# Altium schematic sheet 5-Connector.SchDoc
size A4
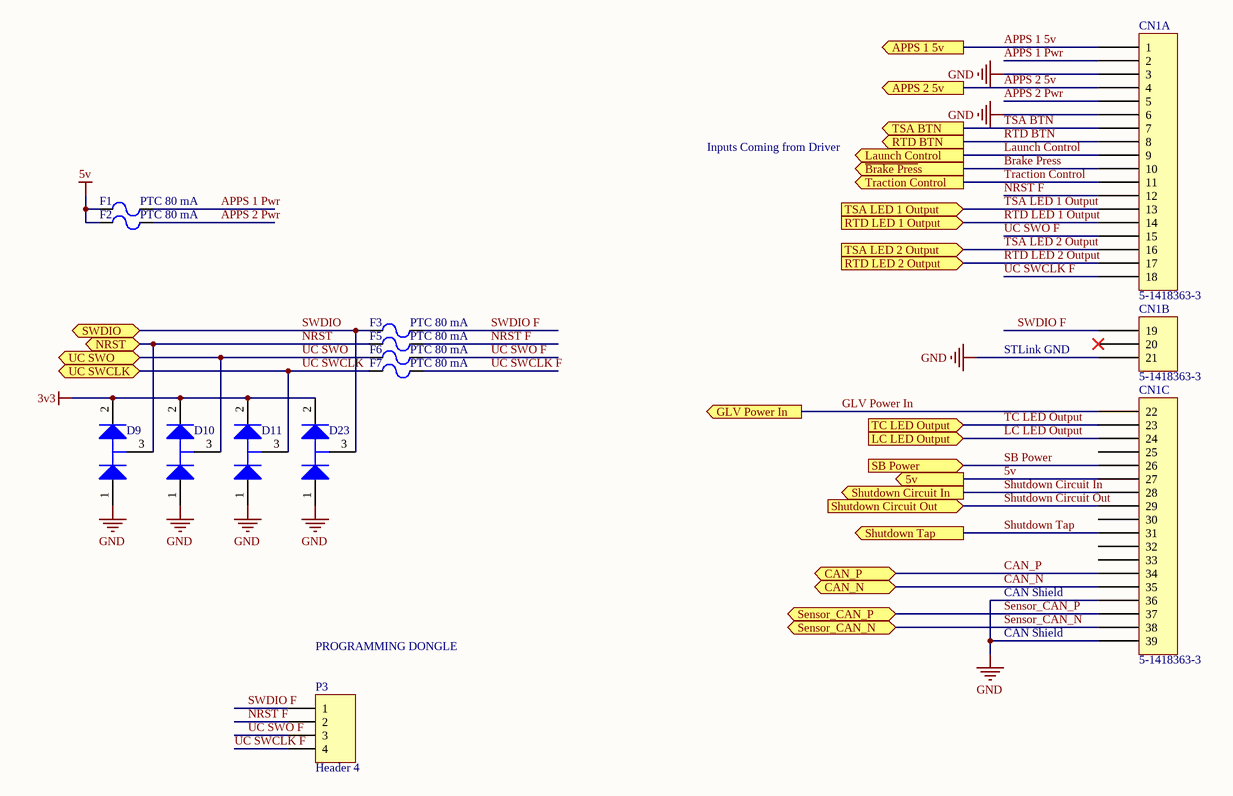
[diagram p0: 5-Connector.SchDoc]

## Parts
CN1  5-1418363-3  [5-1418363-3]  (parts A,B,C of 3)
D9  SZNUP1301ML3T1G  [ONSC-SOT-23-3-318-08_V]  (value not drawn)
D10  SZNUP1301ML3T1G  [ONSC-SOT-23-3-318-08_V]  (value not drawn)
D11  SZNUP1301ML3T1G  [ONSC-SOT-23-3-318-08_V]  (value not drawn)
D23  SZNUP1301ML3T1G  [ONSC-SOT-23-3-318-08_V]  (value not drawn)
F1  PTC 80 mA  [0603 fuse]
F2  PTC 80 mA  [0603 fuse]
F3  PTC 80 mA  [0603 fuse]
F5  PTC 80 mA  [0603 fuse]
F6  PTC 80 mA  [0603 fuse]
F7  PTC 80 mA  [0603 fuse]
P3  Header 4  [HDR1X4]

## Ports
5v (out), APPS 1 5v (out), APPS 2 5v (out), CAN_N (bidir), CAN_P (bidir), GLV Power In (out), Launch Control (out), LC LED Output (in), NRST (bidir), RTD BTN (out), RTD LED 1 Output (in), RTD LED 2 Output (in), SB Power (in), Sensor_CAN_N (bidir), Sensor_CAN_P (bidir), Shutdown Circuit In (out), Shutdown Circuit Out (in), Shutdown Tap (out), SWDIO (bidir), TC LED Output (in), Traction Control (out), TSA BTN (out), TSA LED 1 Output (in), TSA LED 2 Output (in), UC SWCLK (bidir), UC SWO (bidir), ~{Brake Pres}s (out)

## Nets
3v3: D9.2(K) D10.2(K) D11.2(K) D23.2(K)
5v: CN1.27 F1.1 F2.1 ; port 5v
GND: CN1.3 CN1.6 CN1.21 CN1.36 CN1.39 D9.1(A) D10.1(A) D11.1(A) D23.1(A)
~{Brake Pres}s: CN1.10 ; port ~{Brake Pres}s
APPS 1 5v: CN1.1 ; port APPS 1 5v
APPS 1 Pwr: CN1.2 F1.2
APPS 2 5v: CN1.4 ; port APPS 2 5v
APPS 2 Pwr: CN1.5 F2.2
CAN_N: CN1.35 ; port CAN_N
CAN_P: CN1.34 ; port CAN_P
GLV Power In: CN1.22 ; port GLV Power In
Launch Control: CN1.9 ; port Launch Control
LC LED Output: CN1.24 ; port LC LED Output
NRST: D9.3(K/A) F5.1 ; port NRST
NRST F: CN1.12 F5.2 P3.2
RTD BTN: CN1.8 ; port RTD BTN
RTD LED 1 Output: CN1.14 ; port RTD LED 1 Output
RTD LED 2 Output: CN1.17 ; port RTD LED 2 Output
SB Power: CN1.26 ; port SB Power
Sensor_CAN_N: CN1.38 ; port Sensor_CAN_N
Sensor_CAN_P: CN1.37 ; port Sensor_CAN_P
Shutdown Circuit In: CN1.28 ; port Shutdown Circuit In
Shutdown Circuit Out: CN1.29 ; port Shutdown Circuit Out
Shutdown Tap: CN1.31 ; port Shutdown Tap
SWDIO: D23.3(K/A) F3.1 ; port SWDIO
SWDIO F: CN1.19 F3.2 P3.1
TC LED Output: CN1.23 ; port TC LED Output
Traction Control: CN1.11 ; port Traction Control
TSA BTN: CN1.7 ; port TSA BTN
TSA LED 1 Output: CN1.13 ; port TSA LED 1 Output
TSA LED 2 Output: CN1.16 ; port TSA LED 2 Output
UC SWCLK: D11.3(K/A) F7.1 ; port UC SWCLK
UC SWCLK F: CN1.18 F7.2 P3.4
UC SWO: D10.3(K/A) F6.1 ; port UC SWO
UC SWO F: CN1.15 F6.2 P3.3

Not connected (* = marked no-connect by the designer): CN1 20* 25 30 32 33

## Notes on the sheet
- Inputs Coming from Driver
- STLink GND
- CAN Shield
- PROGRAMMING DONGLE

## Library data of the parts
CN1 = 5-1418363-3: Levyseal 90 degree 39 pin header
D9-D11 D23 = CMP-1063-00171-1: Low Capacitance Diode Array for ESD Protection in a Single Data Line, 3-Pin SOT-23, Pb-Free, Tape and Reel; Manufacturer: On Semiconductor; C Max (pF): 0.9; Direction: Bidirectional; V(BR) Min (V): 70; Number of Lines: 1; Mounting Technology: Surface Mount; PackageReference: SOT-23-3-318-08; DatasheetVersion: Rev. 6; PackageVersion: Rev. AP, 11/2009; RoHS: Pb-Free; ComponentLink1Description: Manufacturer URL; ComponentLink1URL: http://www.onsemi.com/; PackageDescription: 3-Pin Small Outline Transistor, Body 2.92 x 1.3 mm, Pitch 0.95 mm; PartNumber: SZNUP1301ML3T1G; Packing: Tape and Reel; ComponentLink3URL: http://www.onsemi.cn/pub_link/Collateral/318-08.PDF; ComponentLink3Description: Package Specification; VRWM Max (V): 70; ComponentLink2Description: Datasheet; ComponentLink2URL: http://www.onsemi.cn/pub_link/Collateral/NUP1301ML3T1-D.PDF; Supplier 1: Mouser; Supplier Part Number 1: 863-SZNUP1301ML3T1G
F1-F3 F5-F7 = PTC fuse 80mA 0ZCM0008FF2G: 0ZCM0008FF2G; Supplier 1: Digi-Key; Supplier Part Number 1: 507-1817-1-ND
P3 = Header 4: Header, 4-Pin; LatestRevisionDate: 17-Jul-2002; LatestRevisionNote: Re-released for DXP Platform.; Publisher: Altium Limited